# EAGLE design GBM16 (EAGLE 5.07)
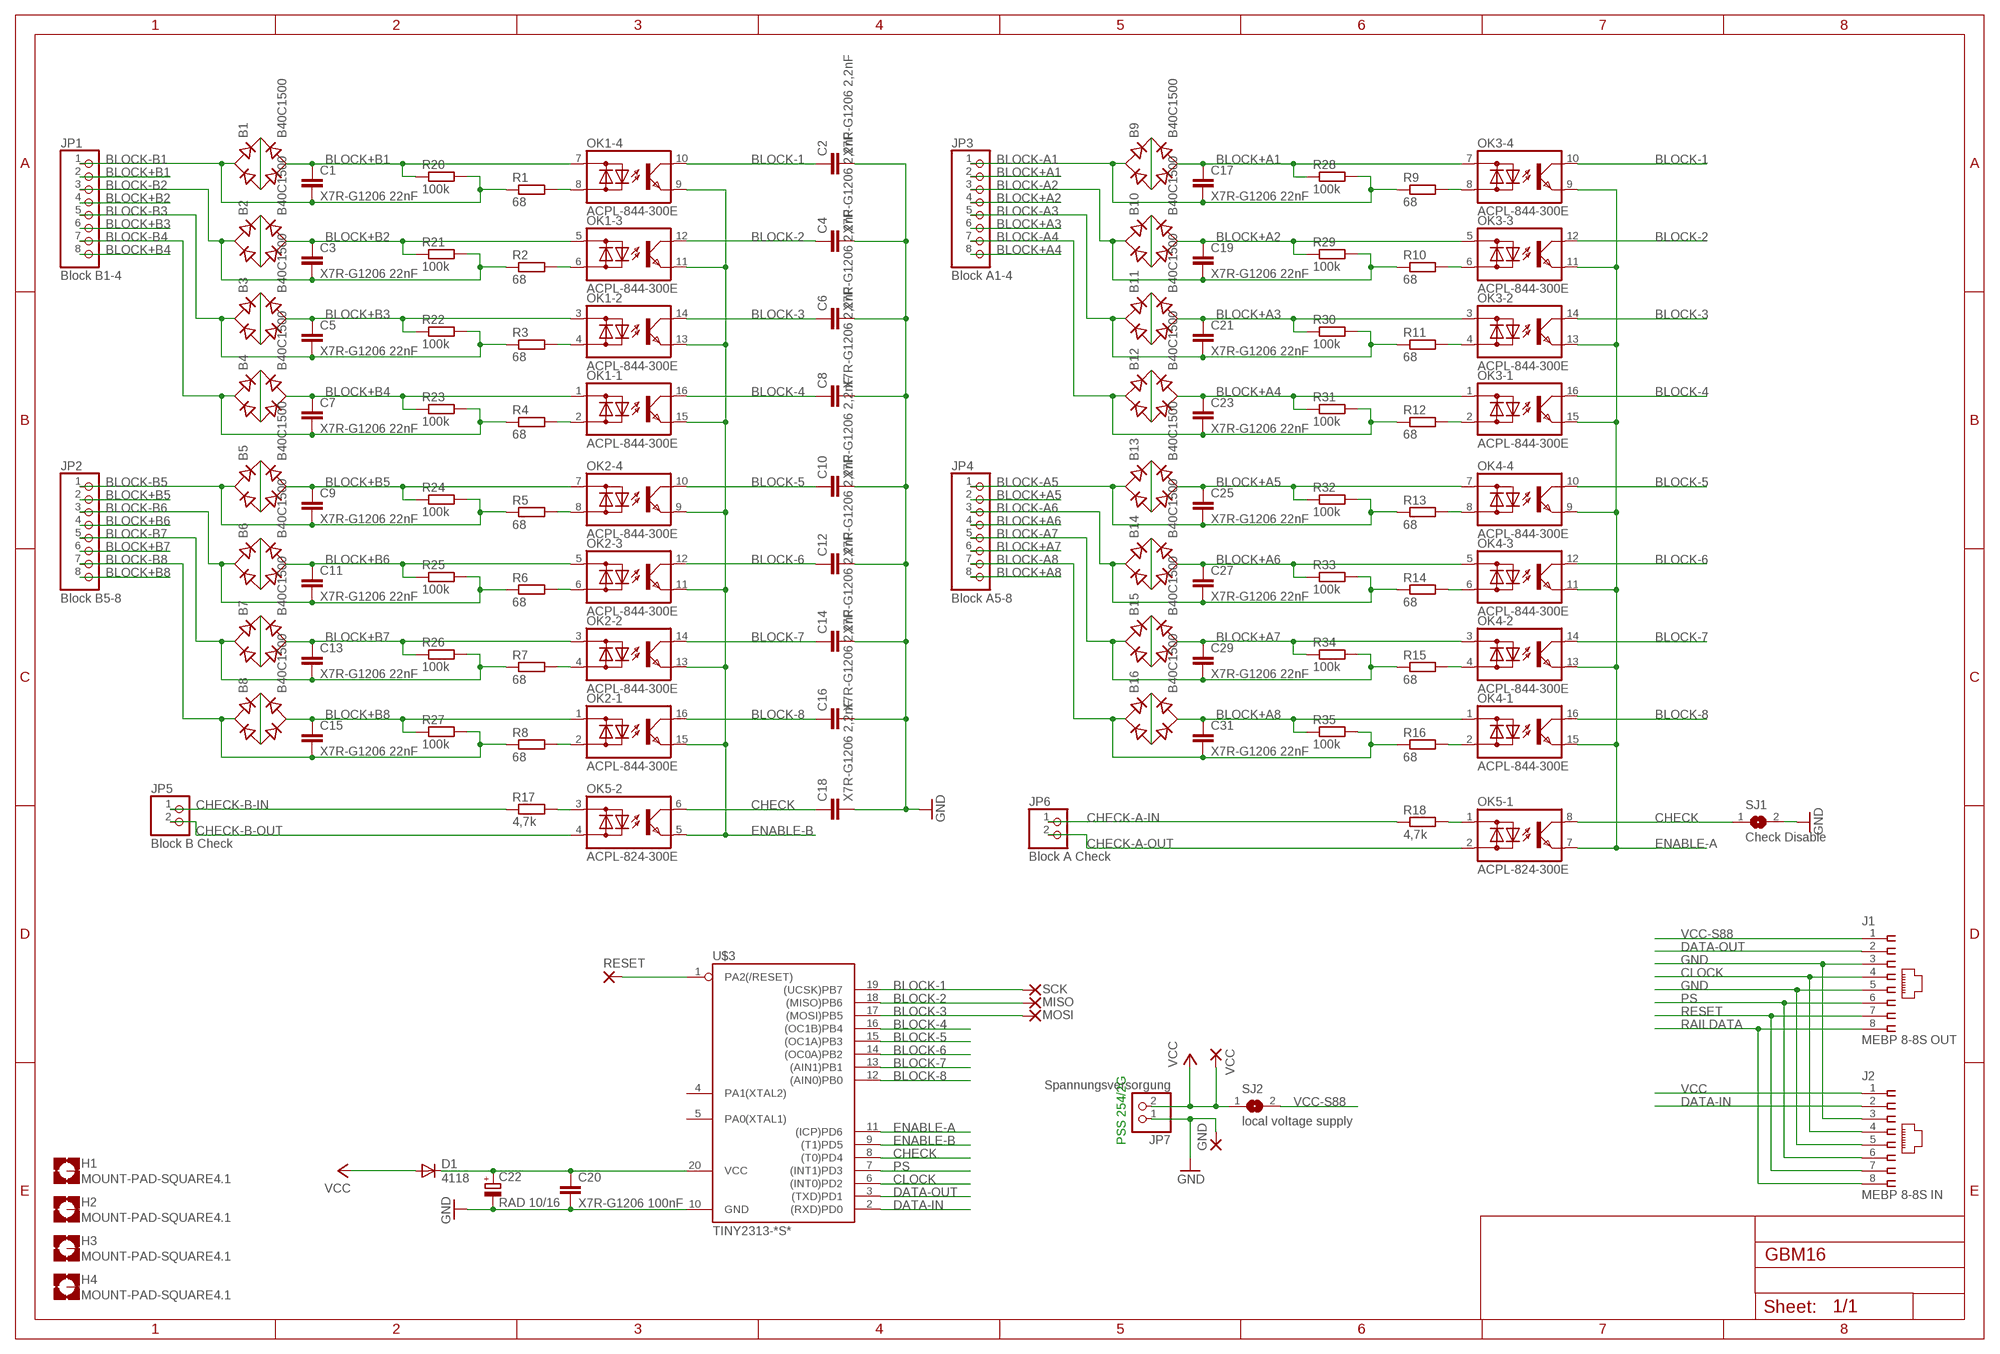
[diagram p0: schematic, sheet 1]

## Parts
B1  B40C1500  RB1A  [RB1A]
B2  B40C1500  RB1A  [RB1A]
B3  B40C1500  RB1A  [RB1A]
B4  B40C1500  RB1A  [RB1A]
B5  B40C1500  RB1A  [RB1A]
B6  B40C1500  RB1A  [RB1A]
B7  B40C1500  RB1A  [RB1A]
B8  B40C1500  RB1A  [RB1A]
B9  B40C1500  RB1A  [RB1A]
B10  B40C1500  RB1A  [RB1A]
B11  B40C1500  RB1A  [RB1A]
B12  B40C1500  RB1A  [RB1A]
B13  B40C1500  RB1A  [RB1A]
B14  B40C1500  RB1A  [RB1A]
B15  B40C1500  RB1A  [RB1A]
B16  B40C1500  RB1A  [RB1A]
C1  X7R-G1206 22nF  C-EUC1206  [C1206]
C2  X7R-G1206 2,2nF  C-EUC1206  [C1206]
C3  X7R-G1206 22nF  C-EUC1206  [C1206]
C4  X7R-G1206 2,2nF  C-EUC1206  [C1206]
C5  X7R-G1206 22nF  C-EUC1206  [C1206]
C6  X7R-G1206 2,2nF  C-EUC1206  [C1206]
C7  X7R-G1206 22nF  C-EUC1206  [C1206]
C8  X7R-G1206 2,2nF  C-EUC1206  [C1206]
C9  X7R-G1206 22nF  C-EUC1206  [C1206]
C10  X7R-G1206 2,2nF  C-EUC1206  [C1206]
C11  X7R-G1206 22nF  C-EUC1206  [C1206]
C12  X7R-G1206 2,2nF  C-EUC1206  [C1206]
C13  X7R-G1206 22nF  C-EUC1206  [C1206]
C14  X7R-G1206 2,2nF  C-EUC1206  [C1206]
C15  X7R-G1206 22nF  C-EUC1206  [C1206]
C16  X7R-G1206 2,2nF  C-EUC1206  [C1206]
C17  X7R-G1206 22nF  C-EUC1206  [C1206]
C18  X7R-G1206 2,2nF  C-EUC1206  [C1206]
C19  X7R-G1206 22nF  C-EUC1206  [C1206]
C20  X7R-G1206 100nF  C-EUC1206  [C1206]
C21  X7R-G1206 22nF  C-EUC1206  [C1206]
C22  RAD 10/16  CPOL-EUE2.5-6  [E2,5-6]
C23  X7R-G1206 22nF  C-EUC1206  [C1206]
C25  X7R-G1206 22nF  C-EUC1206  [C1206]
C27  X7R-G1206 22nF  C-EUC1206  [C1206]
C29  X7R-G1206 22nF  C-EUC1206  [C1206]
C31  X7R-G1206 22nF  C-EUC1206  [C1206]
D1  4118  DIODE-MINIMELF  [MINIMELF]
GND  SMD2  [SMD1,27-2,54]
H1  MOUNT-PAD-SQUARE4.1  [4,1-PAD-SQUARE]
H2  MOUNT-PAD-SQUARE4.1  [4,1-PAD-SQUARE]
H3  MOUNT-PAD-SQUARE4.1  [4,1-PAD-SQUARE]
H4  MOUNT-PAD-SQUARE4.1  [4,1-PAD-SQUARE]
J1  MEBP 8-8S OUT  555162-1  [555162-1]
J2  MEBP 8-8S IN  555162-1  [555162-1]
JP1  Block B1-4  PINHD-1X8  [1X08]
JP2  Block B5-8  PINHD-1X8  [1X08]
JP3  Block A1-4  PINHD-1X8  [1X08]
JP4  Block A5-8  PINHD-1X8  [1X08]
JP5  Block B Check  PINHD-1X2  [1X02]
JP6  Block A Check  PINHD-1X2  [1X02]
JP7  Spannungsversorgung  PINHD-1X2  [1X02]
MISO  SMD2  [SMD1,27-2,54]
MOSI  SMD2  [SMD1,27-2,54]
OK1  ACPL-844-300E  [DIP16]
OK2  ACPL-844-300E  [DIP16]
OK3  ACPL-844-300E  [DIP16]
OK4  ACPL-844-300E  [DIP16]
OK5  ACPL-824-300E  [DIP8]
R1  68  R-EU_R1206  [R1206]
R2  68  R-EU_R1206  [R1206]
R3  68  R-EU_R1206  [R1206]
R4  68  R-EU_R1206  [R1206]
R5  68  R-EU_R1206  [R1206]
R6  68  R-EU_R1206  [R1206]
R7  68  R-EU_R1206  [R1206]
R8  68  R-EU_R1206  [R1206]
R9  68  R-EU_R1206  [R1206]
R10  68  R-EU_R1206  [R1206]
R11  68  R-EU_R1206  [R1206]
R12  68  R-EU_R1206  [R1206]
R13  68  R-EU_R1206  [R1206]
R14  68  R-EU_R1206  [R1206]
R15  68  R-EU_R1206  [R1206]
R16  68  R-EU_R1206  [R1206]
R17  4,7k  R-EU_R1206  [R1206]
R18  4,7k  R-EU_R1206  [R1206]
R20  100k  R-EU_M0805  [M0805]
R21  100k  R-EU_M0805  [M0805]
R22  100k  R-EU_M0805  [M0805]
R23  100k  R-EU_M0805  [M0805]
R24  100k  R-EU_M0805  [M0805]
R25  100k  R-EU_M0805  [M0805]
R26  100k  R-EU_M0805  [M0805]
R27  100k  R-EU_M0805  [M0805]
R28  100k  R-EU_M0805  [M0805]
R29  100k  R-EU_M0805  [M0805]
R30  100k  R-EU_M0805  [M0805]
R31  100k  R-EU_M0805  [M0805]
R32  100k  R-EU_M0805  [M0805]
R33  100k  R-EU_M0805  [M0805]
R34  100k  R-EU_M0805  [M0805]
R35  100k  R-EU_M0805  [M0805]
RESET  SMD2  [SMD1,27-2,54]
SCK  SMD2  [SMD1,27-2,54]
SJ1  Check Disable  SJ  [SJ]
SJ2  local voltage supply  SJ  [SJ]
U$3  TINY2313-*S*  [SO20L$]
VCC  SMD2  [SMD1,27-2,54]

## Nets
BLOCK+A1: B9.AC2 C17.1 JP3.2 OK3.7(-4:AC1) R28.1
BLOCK+A2: B10.AC2 C19.1 JP3.4 OK3.5(-3:AC1) R29.1
BLOCK+A3: B11.AC2 C21.1 JP3.6 OK3.3(-2:AC1) R30.1
BLOCK+A4: B12.AC2 C23.1 JP3.8 OK3.1(-1:AC1) R31.1
BLOCK+A5: B13.AC2 C25.1 JP4.2 OK4.7(-4:AC1) R32.1
BLOCK+A6: B14.AC2 C27.1 JP4.4 OK4.5(-3:AC1) R33.1
BLOCK+A7: B15.AC2 C29.1 JP4.6 OK4.3(-2:AC1) R34.1
BLOCK+A8: B16.AC2 C31.1 JP4.8 OK4.1(-1:AC1) R35.1
BLOCK+B1: B1.AC2 C1.1 JP1.2 OK1.7(-4:AC1) R20.1
BLOCK+B2: B2.AC2 C3.1 JP1.4 OK1.5(-3:AC1) R21.1
BLOCK+B3: B3.AC2 C5.1 JP1.6 OK1.3(-2:AC1) R22.1
BLOCK+B4: B4.AC2 C7.1 JP1.8 OK1.1(-1:AC1) R23.1
BLOCK+B5: B5.AC2 C9.1 JP2.2 OK2.7(-4:AC1) R24.1
BLOCK+B6: B6.AC2 C11.1 JP2.4 OK2.5(-3:AC1) R25.1
BLOCK+B7: B7.AC2 C13.1 JP2.6 OK2.3(-2:AC1) R26.1
BLOCK+B8: B8.AC2 C15.1 JP2.8 OK2.1(-1:AC1) R27.1
BLOCK-1: C2.1 OK1.10(-4:C) OK3.10(-4:C) SCK.1(P) U$3.19((UCSK)PB7)
BLOCK-2: C4.1 MISO.1(P) OK1.12(-3:C) OK3.12(-3:C) U$3.18((MISO)PB6)
BLOCK-3: C6.1 MOSI.1(P) OK1.14(-2:C) OK3.14(-2:C) U$3.17((MOSI)PB5)
BLOCK-4: C8.1 OK1.16(-1:C) OK3.16(-1:C) U$3.16((OC1B)PB4)
BLOCK-5: C10.1 OK2.10(-4:C) OK4.10(-4:C) U$3.15((OC1A)PB3)
BLOCK-6: C12.1 OK2.12(-3:C) OK4.12(-3:C) U$3.14((OC0A)PB2)
BLOCK-7: C14.1 OK2.14(-2:C) OK4.14(-2:C) U$3.13((AIN1)PB1)
BLOCK-8: C16.1 OK2.16(-1:C) OK4.16(-1:C) U$3.12((AIN0)PB0)
BLOCK-A1: B9.AC1 C17.2 JP3.1 R9.1 R28.2
BLOCK-A2: B10.AC1 C19.2 JP3.3 R10.1 R29.2
BLOCK-A3: B11.AC1 C21.2 JP3.5 R11.1 R30.2
BLOCK-A4: B12.AC1 C23.2 JP3.7 R12.1 R31.2
BLOCK-A5: B13.AC1 C25.2 JP4.1 R13.1 R32.2
BLOCK-A6: B14.AC1 C27.2 JP4.3 R14.1 R33.2
BLOCK-A7: B15.AC1 C29.2 JP4.5 R15.1 R34.2
BLOCK-A8: B16.AC1 C31.2 JP4.7 R16.1 R35.2
BLOCK-B1: B1.AC1 C1.2 JP1.1 R1.1 R20.2
BLOCK-B2: B2.AC1 C3.2 JP1.3 R2.1 R21.2
BLOCK-B3: B3.AC1 C5.2 JP1.5 R3.1 R22.2
BLOCK-B4: B4.AC1 C7.2 JP1.7 R4.1 R23.2
BLOCK-B5: B5.AC1 C9.2 JP2.1 R5.1 R24.2
BLOCK-B6: B6.AC1 C11.2 JP2.3 R6.1 R25.2
BLOCK-B7: B7.AC1 C13.2 JP2.5 R7.1 R26.2
BLOCK-B8: B8.AC1 C15.2 JP2.7 R8.1 R27.2
CHECK: C18.1 OK5.6(-2:C) OK5.8(-1:C) SJ1.1 U$3.8((T0)PD4)
CHECK-A-IN: JP6.1 R18.1
CHECK-A-OUT: JP6.2 OK5.2(-1:AC2)
CHECK-B-IN: JP5.1 R17.1
CHECK-B-OUT: JP5.2 OK5.4(-2:AC2)
CLOCK: J1.4 J2.4 U$3.6((INT0)PD2)
DATA-IN: J2.2 U$3.2((RXD)PD0)
DATA-OUT: J1.2 U$3.3((TXD)PD1)
ENABLE-A: OK3.9(-4:E) OK3.11(-3:E) OK3.13(-2:E) OK3.15(-1:E) OK4.9(-4:E) OK4.11(-3:E) OK4.13(-2:E) OK4.15(-1:E) OK5.7(-1:E) U$3.11((ICP)PD6)
ENABLE-B: OK1.9(-4:E) OK1.11(-3:E) OK1.13(-2:E) OK1.15(-1:E) OK2.9(-4:E) OK2.11(-3:E) OK2.13(-2:E) OK2.15(-1:E) OK5.5(-2:E) U$3.9((T1)PD5)
GND: C2.2 C4.2 C6.2 C8.2 C10.2 C12.2 C14.2 C16.2 C18.2 C20.2 C22.- GND.1(P) J1.3 J1.5 J2.3 J2.5 JP7.1 SJ1.2 U$3.10(GND)
N$1: C20.1 C22.+ D1.C U$3.20(VCC)
N$3: OK1.8(-4:AC2) R1.2
N$5: B1.+ B1.-
N$6: OK5.3(-2:AC1) R17.2
N$7: OK5.1(-1:AC1) R18.2
N$10: B2.+ B2.-
N$11: OK2.6(-3:AC2) R6.2
N$13: OK1.6(-3:AC2) R2.2
N$14: OK2.4(-2:AC2) R7.2
N$15: B3.+ B3.-
N$16: OK1.4(-2:AC2) R3.2
N$17: OK2.8(-4:AC2) R5.2
N$18: OK1.2(-1:AC2) R4.2
N$19: B4.+ B4.-
N$20: OK2.2(-1:AC2) R8.2
N$21: OK3.8(-4:AC2) R9.2
N$23: OK3.6(-3:AC2) R10.2
N$24: B5.+ B5.-
N$25: RESET.1(P) U$3.1(PA2(/RESET))
N$26: OK3.4(-2:AC2) R11.2
N$27: B6.+ B6.-
N$29: OK4.6(-3:AC2) R14.2
N$32: OK3.2(-1:AC2) R12.2
N$35: B7.+ B7.-
N$36: OK4.4(-2:AC2) R15.2
N$39: B8.+ B8.-
N$41: OK4.8(-4:AC2) R13.2
N$42: OK4.2(-1:AC2) R16.2
N$44: B9.+ B9.-
N$47: B10.+ B10.-
N$55: B11.+ B11.-
N$59: B12.+ B12.-
N$65: B13.+ B13.-
N$68: B14.+ B14.-
N$76: B15.+ B15.-
N$80: B16.+ B16.-
PS: J1.6 J2.6 U$3.7((INT1)PD3)
RAILDATA: J1.8 J2.8
RESET: J1.7 J2.7
VCC: D1.A J2.1 JP7.2 SJ2.1 VCC.1(P)
VCC-S88: J1.1 SJ2.2
Unconnected: H1.B4,1(MOUNT) H2.B4,1(MOUNT) H3.B4,1(MOUNT) H4.B4,1(MOUNT) U$3.4(PA1(XTAL2)) U$3.5(PA0(XTAL1))

## Notes on the sheet
- PSS 254/2G

## Library data of the parts
B1-B16 = rectifier:RB1A: RECTIFIER 1 A
C1-C21 C23 C25 C27 C29 C31 = rcl:C-EU: CAPACITOR, European symbol
C22 = rcl:CPOL-EU: POLARIZED CAPACITOR, European symbol
D1 = diode:DIODE-: DIODE
GND MISO MOSI RESET SCK VCC = wirepad:SMD2: SMD PAD
H1-H4 = holes:MOUNT-PAD-SQUARE: MOUNTING PAD, square
J1 J2 = con-amp:555162-1: AMP connector
JP1-JP4 = pinhead:PINHD-1X8: PIN HEADER
JP5-JP7 = pinhead:PINHD-1X2: PIN HEADER
OK1-OK4 = my-optocoupler:ACPL-844-300E: FOTOTRANSISTOR/OPTOKOPPLER ACPL-844-300E Conrad Artikel-Nr.: 140222 - 62
OK5 = my-optocoupler:ACPL-824-300E: FOTOTRANSISTOR/OPTOKOPPLER ACPL-824-300E Conrad Artikel-Nr.: 140220 - 62
R1-R18 R20-R35 = rcl:R-EU_: RESISTOR, European symbol
SJ1 SJ2 = jumper:SJ: SMD solder JUMPER
U$3 = avr-6:TINY2313*: Atmel Tiny2313 2K Flash, 128 bytes EEPROM, 128 bytes RAM

## Board
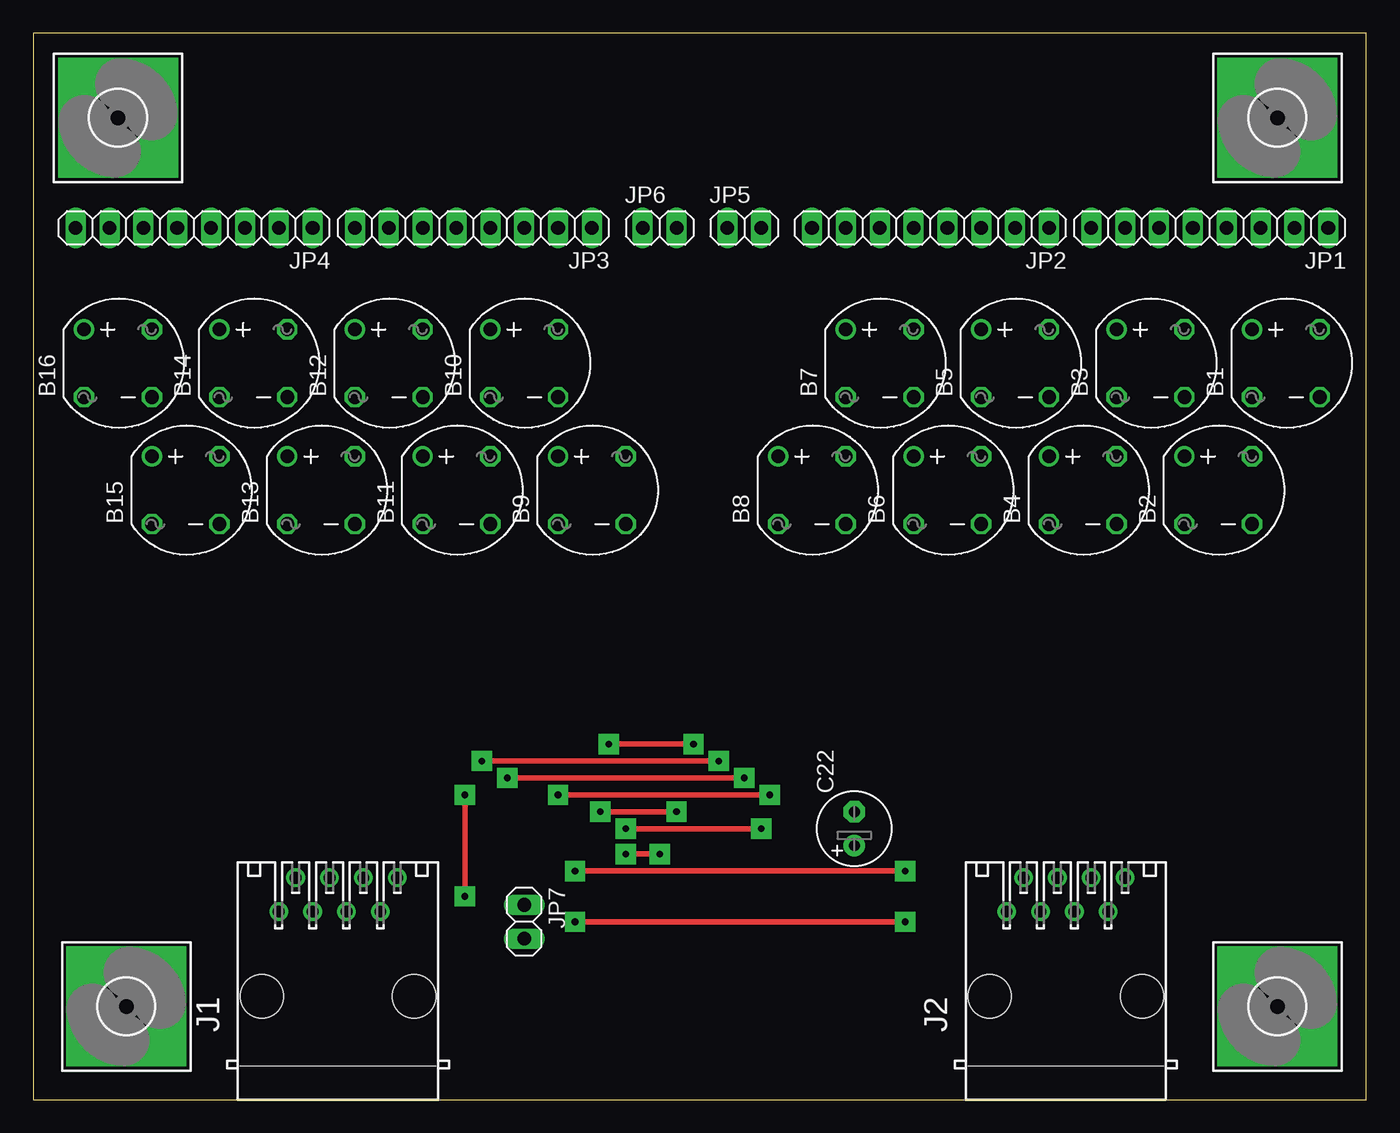
[diagram p1: board, top side]
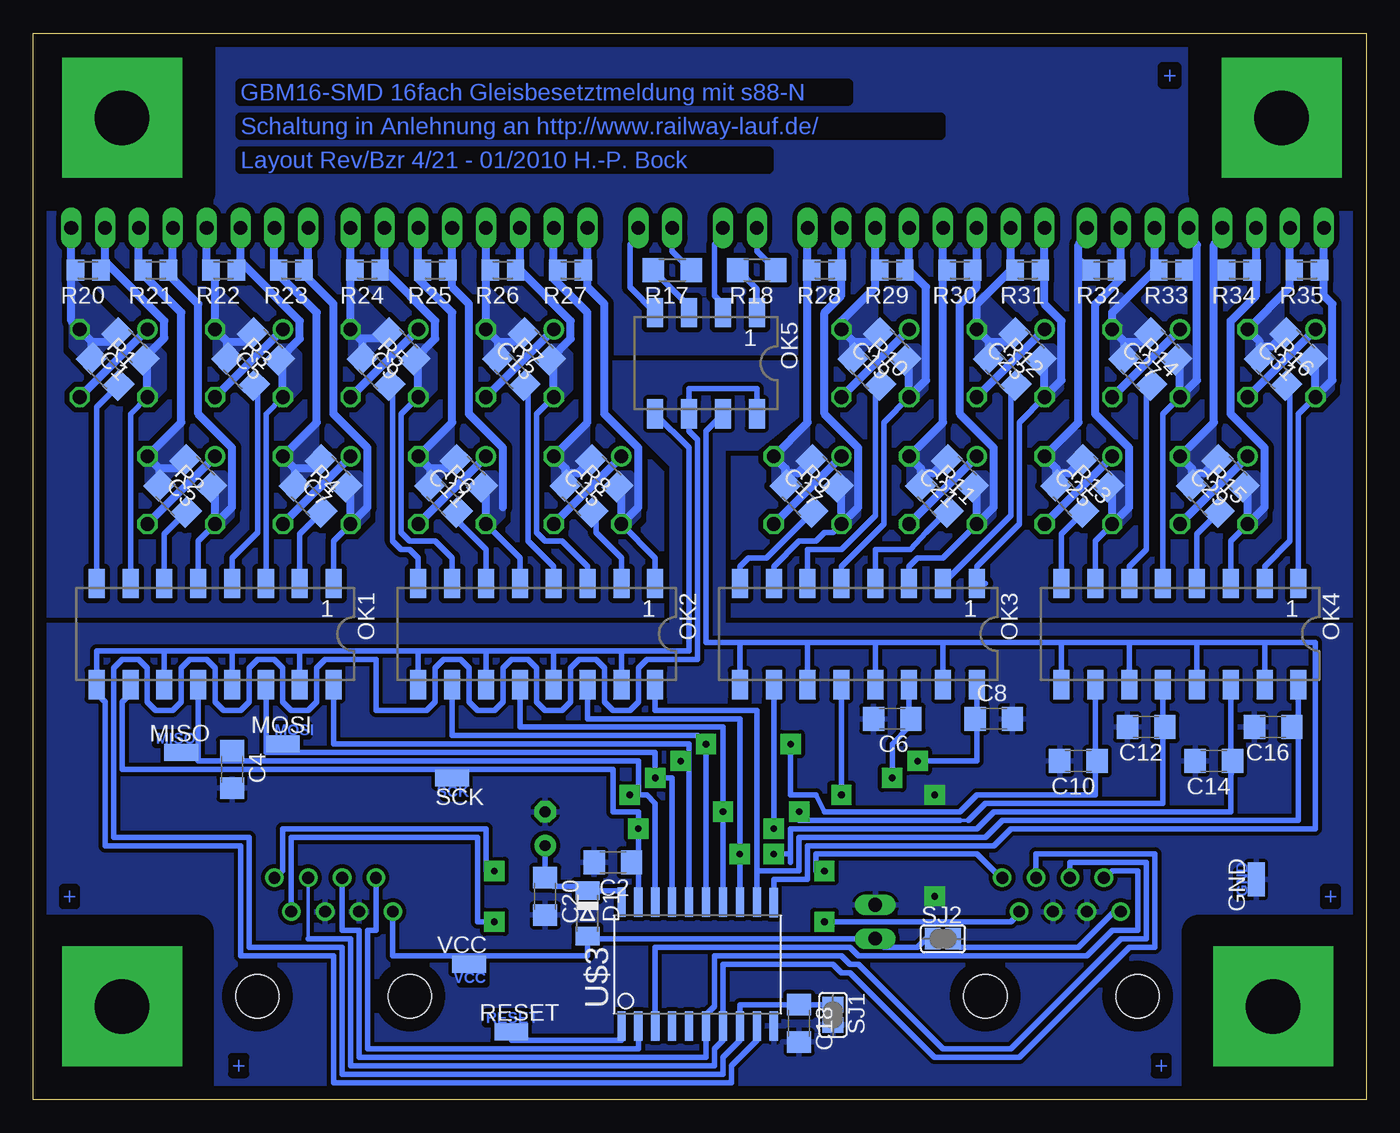
[diagram p2: board, bottom side, seen from below]

Size 100 x 80 mm. Coordinates in mm from the lower left corner, seen from the top.
Outline: 0,0 100,0 100,80 0,80 0,0
Copper layers (1*16): Top 0.035mm / dielectric 1.5mm / Bottom 0.035mm
Design rules "default": minimum track width 10mil, minimum drill 24mil, track to track 8mil, track to pad 8mil, pad to pad 8mil, via to via 8mil, smd to smd 8mil, copper to edge 40mil, drill to drill 8mil, minimum pad ring 10mil, minimum via ring 8mil, stop-mask expansion 4mil, vias tented up to drill 0mil, thermal gap 10mil

### Footprints (pad centres in the part's own frame; a part is rotated, then mirrored left to right if it is on the bottom)
RB1A = drill 1.016 round: + -2.54,2.54 | drill 1.016 octagon: - 2.54,-2.54; AC1 2.54,2.54; AC2 -2.54,-2.54
C1206 = smd 1.6 x 1.8: 1 -1.4,0; 2 1.4,0
E2,5-6 = drill 0.813 pad 1.6 round: + -1.27,0 | drill 0.813 pad 1.6 octagon: - 1.27,0
MINIMELF = smd 1.4 x 1.8: A 1.7,0; C -1.7,0
SMD1,27-2,54 = smd 1.27 x 2.54: 1 0,0
4,1-PAD-SQUARE = drill 4.1 pad 9 square: B4,1 0,0
555162-1 = drill 0.889 round: 1 -4.445,5.207; 2 -3.175,7.747; 3 -1.905,5.207; 4 -0.635,7.747; 5 0.635,5.207; 6 1.905,7.747; 7 3.175,5.207; 8 4.445,7.747 | hole 3.251: -5.715,-1.143; 5.715,-1.143
1X08 = drill 1.016 long: 1 -8.89,0; 2 -6.35,0; 3 -3.81,0; 4 -1.27,0; 5 1.27,0; 6 3.81,0; 7 6.35,0; 8 8.89,0
1X02 = drill 1.016 long: 1 -1.27,0; 2 1.27,0
DIP16 = smd 1.2 x 2.2: 1 -8.89,-3.8; 2 -6.35,-3.8; 3 -3.81,-3.8; 4 -1.27,-3.8; 5 1.27,-3.8; 6 3.81,-3.8; 7 6.35,-3.8; 8 8.89,-3.8; 9 8.89,3.8; 10 6.35,3.8; 11 3.81,3.8; 12 1.27,3.8; 13 -1.27,3.8; 14 -3.81,3.8; 15 -6.35,3.8; 16 -8.89,3.8
DIP8 = smd 1.2 x 2.2: 1 -3.81,-3.8; 2 -1.27,-3.8; 3 1.27,-3.8; 4 3.81,-3.8; 5 3.81,3.8; 6 1.27,3.8; 7 -1.27,3.8; 8 -3.81,3.8
R1206 = smd 1.6 x 1.803: 1 -1.422,0; 2 1.422,0
M0805 = smd 1.3 x 1.6: 1 -0.95,0; 2 0.95,0
SJ = smd 1.168 x 1.6: 1 -0.762,0; 2 0.762,0
SO20L$ = smd 0.61 x 2.21: 1 -5.715,-4.636; 2 -4.445,-4.636; 3 -3.175,-4.636; 4 -1.905,-4.636; 5 -0.635,-4.636; 6 0.635,-4.636; 7 1.905,-4.636; 8 3.175,-4.636; 9 4.445,-4.636; 10 5.715,-4.636; 11 5.715,4.61; 12 4.445,4.636; 13 3.175,4.636; 14 1.905,4.636; 15 0.635,4.636; 16 -0.635,4.636; 17 -1.905,4.636; 18 -3.175,4.636; 19 -4.445,4.636; 20 -5.715,4.636

### Placement (x,y rotation side)
B1  93.98,55.24 0 top
B2  88.9,45.72 0 top
B3  83.82,55.24 0 top
B4  78.74,45.72 0 top
B5  73.66,55.24 0 top
B6  68.58,45.72 0 top
B7  63.5,55.24 0 top
B8  58.42,45.72 0 top
B9  41.91,45.72 0 top
B10  36.83,55.24 0 top
B11  31.75,45.72 0 top
B12  26.67,55.24 0 top
B13  21.59,45.72 0 top
B14  16.51,55.24 0 top
B15  11.43,45.72 0 top
B16  6.35,55.24 0 top
C1  92.71,56.52 135 bottom
C2  56.52,17.78 180 bottom
C3  87.63,46.99 135 bottom
C4  85.09,24.77 270 bottom
C5  82.55,56.52 135 bottom
C6  35.56,28.57 180 bottom
C7  77.47,46.99 135 bottom
C8  27.94,28.57 0 bottom
C9  72.39,56.52 135 bottom
C10  21.59,25.4 180 bottom
C11  67.31,46.99 135 bottom
C12  16.51,27.94 180 bottom
C13  62.23,56.52 135 bottom
C14  11.43,25.4 180 bottom
C15  57.15,46.99 135 bottom
C16  6.99,27.94 180 bottom
C17  40.64,46.99 135 bottom
C18  42.55,5.71 270 bottom
C19  35.56,56.52 135 bottom
C20  61.59,15.24 270 bottom
C21  30.48,46.99 135 bottom
C22  61.59,20.32 90 top
C23  25.4,56.52 135 bottom
C25  20.32,46.99 135 bottom
C27  15.24,56.52 135 bottom
C29  10.16,46.99 135 bottom
C31  5.08,56.52 135 bottom
D1  58.42,13.97 270 bottom
GND  8.26,16.51 0 bottom
H1  6.35,73.66 0 top
H2  93.34,73.66 0 top
H3  6.99,6.99 0 top
H4  93.34,6.99 0 top
J1  22.86,8.89 0 top
J2  77.47,8.89 0 top
JP1  88.27,65.41 180 top
JP2  67.31,65.41 180 top
JP3  33.02,65.41 180 top
JP4  12.06,65.41 180 top
JP5  53.34,65.41 0 top
JP6  46.99,65.41 0 top
JP7  36.83,13.34 270 top
MISO  88.9,26.04 270 bottom
MOSI  81.28,26.67 270 bottom
OK1  86.36,34.92 180 bottom
OK2  62.23,34.92 180 bottom
OK3  38.1,34.92 180 bottom
OK4  13.97,34.92 180 bottom
OK5  49.53,55.24 180 bottom
R1  94.61,54.61 315 bottom
R2  89.53,45.09 315 bottom
R3  84.45,54.61 315 bottom
R4  79.38,45.09 315 bottom
R5  74.3,54.61 315 bottom
R6  69.22,45.09 315 bottom
R7  64.14,54.61 315 bottom
R8  59.05,45.09 315 bottom
R9  42.55,45.09 315 bottom
R10  37.47,54.61 315 bottom
R11  32.38,45.09 315 bottom
R12  27.3,54.61 315 bottom
R13  22.23,45.09 315 bottom
R14  17.14,54.61 315 bottom
R15  12.06,45.09 315 bottom
R16  6.99,54.61 315 bottom
R17  52.07,62.23 180 bottom
R18  45.72,62.23 180 bottom
R20  95.89,62.23 180 bottom
R21  90.81,62.23 180 bottom
R22  85.72,62.23 180 bottom
R23  80.64,62.23 180 bottom
R24  74.93,62.23 180 bottom
R25  69.85,62.23 180 bottom
R26  64.77,62.23 180 bottom
R27  59.69,62.23 180 bottom
R28  40.64,62.23 180 bottom
R29  35.56,62.23 180 bottom
R30  30.48,62.23 180 bottom
R31  25.4,62.23 180 bottom
R32  19.68,62.23 180 bottom
R33  14.61,62.23 180 bottom
R34  9.53,62.23 180 bottom
R35  4.45,62.23 180 bottom
RESET  64.14,5.08 270 bottom
SCK  68.58,24.13 90 bottom
SJ1  40.01,6.35 270 bottom
SJ2  31.75,12.06 0 bottom
U$3  50.16,10.16 0 bottom
VCC  67.31,10.16 270 bottom

### Tracks (layer width: path | path; a pad name or v marks a point on that pad's centre or on a via)
BLOCK+A1
  Bottom 0.406: B9.AC2 40.01,42.55 40.64,42.55 41.27,41.91 42.55,41.91 44.45,40.01 OK3.7 | 39.37,60.33 39.37,61.91 R28.1
  Bottom 0.6: C17.1 39.37,45.72 B9.AC2 38.1,44.45 38.1,48.9 40.64,51.44 40.64,59.05 39.37,60.33 JP3.2
  pour Bottom (isolate 0.254, no thermals): 39.37,42.55 38.1,43.81 38.1,46.35 38.73,46.99 39.37,46.99
BLOCK+A2
  Bottom 0.406: B10.AC2 36.2,50.8 36.2,43.18 39.37,40.01 OK3.5 | 34.29,62.23 R29.1
  Bottom 0.6: C19.1 34.29,55.24 B10.AC2 33.02,53.98 33.02,60.96 34.29,62.23 JP3.4
  pour Bottom (isolate 0.254, no thermals): 34.29,52.07 33.02,53.34 33.02,55.88 33.66,56.52 34.29,56.52
BLOCK+A3
  Bottom 0.406: B11.AC2 31.75,40.64 33.66,40.64 34.29,40.01 OK3.3 | 29.21,60.96 29.21,61.91 R30.1
  Bottom 0.6: C21.1 29.21,45.72 B11.AC2 27.94,44.45 27.94,48.9 30.48,51.44 30.48,59.69 29.21,60.96 JP3.6
  pour Bottom (isolate 0.254, no thermals): 29.21,42.55 27.94,43.81 27.94,46.35 28.57,46.99 29.21,46.99
BLOCK+A4
  Bottom 0.406: B12.AC2 26.04,50.8 26.04,43.18 29.21,40.01 OK3.1 28.59,38.73 | 24.13,59.69 24.13,61.91 R31.1
  Bottom 0.6: C23.1 24.13,55.24 B12.AC2 22.86,53.98 22.86,58.42 24.13,59.69 JP3.8
  pour Bottom (isolate 0.254, no thermals): 24.13,52.07 22.86,53.34 22.86,55.88 23.5,56.52 24.13,56.52
BLOCK+A5
  Bottom 0.406: B13.AC2 20.32,41.91 OK4.7 | 18.41,61.59 18.41,61.91 R32.1
  Bottom 0.6: C25.1 19.05,45.72 B13.AC2 17.78,44.45 17.78,48.9 20.32,51.44 20.32,59.69 18.41,61.59 JP4.2
  pour Bottom (isolate 0.254, no thermals): 19.05,42.55 17.78,43.81 17.78,46.35 18.41,46.99 19.05,46.99
BLOCK+A6
  Bottom 0.406: B14.AC2 15.24,51.44 OK4.5 | 12.7,64.14 12.7,63.19 R33.1
  Bottom 0.6: C27.1 13.97,55.24 B14.AC2 12.7,53.98 12.7,64.14 13.34,64.77 JP4.4
  pour Bottom (isolate 0.254, no thermals): 13.97,52.07 12.7,53.34 12.7,55.88 13.34,56.52 13.97,56.52
BLOCK+A7
  Bottom 0.406: B15.AC2 10.16,41.91 OK4.3 | 8.26,60.33 8.26,61.91 R34.1
  Bottom 0.6: C29.1 8.89,45.72 B15.AC2 7.62,44.45 7.62,48.9 10.16,51.44 10.16,58.42 8.26,60.33 JP4.6
  pour Bottom (isolate 0.254, no thermals): 8.89,42.55 7.62,43.81 7.62,46.35 8.26,46.99 8.89,46.99
BLOCK+A8
  Bottom 0.406: B16.AC2 5.08,51.44 OK4.1 | 3.17,60.33 3.17,61.91 R35.1
  Bottom 0.6: C31.1 3.81,55.24 B16.AC2 2.54,53.98 2.54,59.69 3.17,60.33 JP4.8
  pour Bottom (isolate 0.254, no thermals): 3.81,52.07 2.54,53.34 2.54,55.88 3.17,56.52 3.81,56.52
BLOCK+B1
  Bottom 0.406: B1.AC2 92.71,51.44 OK1.7 | 94.61,62.87 94.61,62.55 R20.1
  Bottom 0.6: B1.AC2 91.44,55.24 C1.1 91.72,55.6 90.17,57.15 90.17,58.42 94.61,62.87 JP1.2
  pour Bottom (isolate 0.254, no thermals): 91.44,52.07 90.17,53.34 90.17,55.88 90.81,56.52 91.44,56.52
BLOCK+B2
  Bottom 0.406: B2.AC2 87.63,41.91 OK1.5 | 89.53,61.59 89.53,61.91 R21.1
  Bottom 0.6: C3.1 86.36,45.72 B2.AC2 85.09,44.45 85.09,48.9 87.63,51.44 87.63,59.69 89.53,61.59 JP1.4
  pour Bottom (isolate 0.254, no thermals): 86.36,42.55 85.09,43.81 85.09,46.35 85.72,46.99 86.36,46.99
BLOCK+B3
  Bottom 0.406: B3.AC2 82.55,51.44 OK1.3 | 84.45,62.87 84.45,62.55 R22.1
  Bottom 0.6: B3.AC2 81.28,55.24 C5.1 80.01,57.08 80.01,58.42 84.45,62.87 JP1.6
  pour Bottom (isolate 0.254, no thermals): 81.28,52.07 80.01,53.34 80.01,55.88 80.64,56.52 81.28,56.52
BLOCK+B4
  Bottom 0.406: B4.AC2 77.47,41.91 OK1.1 | 79.38,61.59 79.38,61.91 R23.1
  Bottom 0.6: C7.1 76.2,45.72 B4.AC2 74.93,44.45 74.93,48.9 77.47,51.44 77.47,59.69 79.38,61.59 JP1.8
  pour Bottom (isolate 0.254, no thermals): 76.2,42.55 74.93,43.81 74.93,46.35 75.56,46.99 76.2,46.99
BLOCK+B5
  Bottom 0.406: B5.AC2 72.39,51.44 72.39,42.55 71.75,41.91 69.85,41.91 68.58,40.64 OK2.7 | 73.66,62.23 R24.1
  Bottom 0.6: B5.AC2 71.12,55.24 C9.1 69.85,57.08 69.85,58.42 73.66,62.23 JP2.2
  pour Bottom (isolate 0.254, no thermals): 71.12,52.07 69.85,53.34 69.85,55.88 70.48,56.52 71.12,56.52
BLOCK+B6
  Bottom 0.406: B6.AC2 63.5,40.64 OK2.5 | 68.58,60.96 68.58,61.91 R25.1
  Bottom 0.6: B6.AC2 66.04,45.72 C11.1 | JP2.4 68.58,60.96 67.31,59.69 67.31,51.44 64.77,48.9 64.77,44.45
  pour Bottom (isolate 0.254, no thermals): 66.04,42.55 64.77,43.81 64.77,46.35 65.41,46.99 66.04,46.99
BLOCK+B7
  Bottom 0.406: B7.AC2 62.23,51.44 62.23,42.55 61.59,41.91 60.33,41.91 58.42,40.01 OK2.3 | 63.5,62.23 R26.1
  Bottom 0.6: B7.AC2 60.96,55.24 C13.1 59.69,57.08 59.69,58.42 63.5,62.23 JP2.6
  pour Bottom (isolate 0.254, no thermals): 60.96,52.07 59.69,53.34 59.69,55.88 60.33,56.52 60.96,56.52
BLOCK+B8
  Bottom 0.406: B8.AC2 53.34,40.64 OK2.1 | 58.42,60.96 58.42,61.91 R27.1
  Bottom 0.6: C15.1 55.88,45.72 B8.AC2 54.61,44.45 54.61,48.9 57.15,51.44 57.15,59.69 58.42,60.96 JP2.8
  pour Bottom (isolate 0.254, no thermals): 55.88,42.55 54.61,43.81 54.61,46.35 55.24,46.99 55.88,46.99
BLOCK-1  (via drill 0.5 pad 1.52)
  Top 0.406: v44.45,20.32 v54.61,20.32
  Bottom 0.406: OK1.10 92.71,30.48 93.34,29.84 93.34,24.77 68.58,24.77 | 68.58,24.77 56.52,24.77 56.52,21.59 54.61,21.59 v54.61,20.32 54.61,17.78 | 54.61,17.78 U$3.19 | v44.45,20.32 OK3.10 | 54.61,17.78 C2.1 | 68.58,24.77 SCK.1
BLOCK-2  (via drill 0.5 pad 1.52)
  Top 0.406: v39.37,22.86 v55.24,22.86
  Bottom 0.406: U$3.18 53.34,22.23 53.98,22.86 54.61,22.86 | v55.24,22.86 54.61,22.86 | 54.61,22.86 54.61,25.4 84.45,25.4 | 87.63,26.04 87.63,25.4 84.45,25.4 | 87.63,26.04 OK1.12 | v39.37,22.86 OK3.12 | 84.45,25.4 C4.1 | 87.63,26.04 MISO.1
BLOCK-3  (via drill 0.5 pad 1.52)
  Top 0.406: v35.56,24.13 v53.34,24.13
  Bottom 0.406: U$3.17 52.07,24.13 v53.34,24.13 53.34,26.04 80.64,26.04 | 80.64,26.04 82.55,26.04 OK1.14 | 34.29,27.94 OK3.14 | v35.56,24.13 35.56,26.67 34.29,27.94 | C6.1 34.16,27.94 34.29,27.94 | 80.64,26.04 MOSI.1
BLOCK-4  (via drill 0.5 pad 1.52)
  Top 0.406: v33.66,25.4 v51.44,25.4
  Bottom 0.406: v33.66,25.4 29.21,25.4 OK3.16 29.21,28.57 C8.1 | 50.8,25.4 v51.44,25.4 50.8,25.4 | 50.8,25.4 U$3.16 | 50.8,25.4 50.8,26.67 77.47,26.67 OK1.16
BLOCK-5  (via drill 0.5 pad 1.52)
  Top 0.406: v43.18,26.67 v49.53,26.67
  Bottom 0.406: OK2.10 68.58,27.3 50.16,27.3 v49.53,26.67 U$3.15 | v43.18,26.67 43.18,22.86 41.27,22.86 40.64,21.59 30.48,21.59 29.21,22.86 20.32,22.86 20.32,24.77 | 20.32,24.77 OK4.10 | C10.1 20.19,24.77 20.32,24.77
BLOCK-6  (via drill 0.5 pad 1.52)
  Top 0.406: v42.55,21.59 v48.26,21.59
  Bottom 0.254: 29.84,20.95 30.48,20.95
  Bottom 0.406: OK2.12 63.5,27.94 48.26,27.94 v48.26,21.59 U$3.14 | 15.24,22.23 OK4.12 | 15.24,22.23 28.57,22.23 29.84,20.95 | 30.48,20.95 42.55,20.95 v42.55,21.59 | 15.24,22.23 15.24,27.3 C12.1
BLOCK-7  (via drill 0.5 pad 1.52)
  Top 0.406: v44.45,18.41 v46.99,18.41
  Bottom 0.406: OK2.14 58.42,28.57 46.99,28.57 v46.99,18.41 U$3.13 | 10.16,21.59 OK4.14 | 10.16,21.59 27.94,21.59 29.21,20.32 43.18,20.32 43.18,18.41 | 43.18,18.41 43.18,17.78 | 43.18,18.41 v44.45,18.41 | 10.16,21.59 10.16,24.13 C14.1
BLOCK-8
  Bottom 0.406: OK2.16 53.34,29.21 45.72,29.21 45.72,17.14 | 45.72,17.14 U$3.12 | 45.72,17.14 42.55,17.14 42.55,19.68 28.57,19.68 27.3,20.95 5.08,20.95 OK4.16 5.08,27.94 C16.1
BLOCK-A1
  Bottom 0.406: JP3.1 41.91,62.55 R28.2
  Bottom 0.6: 43.55,46.99 R9.1 | 43.55,46.99 43.55,47.36 B9.AC1 41.91,50.8 JP3.1 | C17.2 42.62,46.99 43.55,46.99
  pour Bottom (isolate 0.254, no thermals): 41.27,48.26 43.81,45.72 44.45,46.35 44.45,48.26 41.91,50.8 41.91,48.9
BLOCK-A2
  Bottom 0.406: 36.83,61.91 R29.2
  Bottom 0.6: 38.47,56.89 B10.AC1 39.37,58.42 36.83,60.96 36.83,61.91 JP3.3 | R10.1 38.47,56.89 | C19.2 37.17,56.89 38.47,56.89
  pour Bottom (isolate 0.254, no thermals): 36.2,57.78 38.73,55.24 39.37,55.88 39.37,57.78 36.83,60.33 36.83,58.42
BLOCK-A3
  Bottom 0.406: JP3.5 31.75,62.55 R30.2
  Bottom 0.6: 33.39,46.99 R11.1 | 33.39,46.99 33.39,47.36 B11.AC1 31.75,50.8 JP3.5 | C21.2 32.46,46.99 33.39,46.99
  pour Bottom (isolate 0.254, no thermals): 31.11,48.26 33.66,45.72 34.29,46.35 34.29,48.26 31.75,50.8 31.75,48.9
BLOCK-A4
  Bottom 0.406: 26.67,62.23 R31.2
  Bottom 0.6: 28.31,56.89 B12.AC1 29.21,59.69 26.67,62.23 JP3.7 | R12.1 28.31,56.89 | C23.2 27.01,56.89 28.31,56.89
  pour Bottom (isolate 0.254, no thermals): 26.04,57.78 28.57,55.24 29.21,55.88 29.21,60.96
BLOCK-A5
  Bottom 0.406: 21.59,64.14 21.59,63.19 R32.2
  Bottom 0.6: 23.23,46.99 R13.1 | 23.23,46.99 23.23,47.36 B13.AC1 21.59,50.8 21.59,64.14 20.95,64.77 JP4.1 | C25.2 22.3,46.99 23.23,46.99
  pour Bottom (isolate 0.254, no thermals): 20.95,48.26 23.5,45.72 24.13,46.35 24.13,48.26 21.59,50.16 21.59,48.9
BLOCK-A6
  Bottom 0.406: 15.88,62.23 R33.2
  Bottom 0.6: 18.15,56.89 B14.AC1 19.05,59.05 15.88,62.23 JP4.3 | R14.1 18.15,56.89 | C27.2 16.85,56.89 18.15,56.89
  pour Bottom (isolate 0.254, no thermals): 15.88,57.78 18.41,55.24 19.05,55.88 19.05,60.96
BLOCK-A7
  Bottom 0.406: 11.43,62.23 R34.2
  Bottom 0.6: 13.07,46.99 R15.1 | 13.07,46.99 13.07,47.36 B15.AC1 11.43,50.8 11.43,62.23 11.43,64.14 10.79,64.77 JP4.5 | C29.2 12.14,46.99 13.07,46.99
  pour Bottom (isolate 0.254, no thermals): 10.79,48.26 13.34,45.72 13.97,46.35 13.97,48.26 11.43,50.8 11.43,48.9
BLOCK-A8
  Bottom 0.406: 5.71,60.96 5.71,61.91 R35.2
  Bottom 0.6: R16.1 7.99,56.52 | 7.99,56.52 7.99,56.89 B16.AC1 5.71,60.96 JP4.7 | C31.2 7.06,56.52 7.99,56.52
  pour Bottom (isolate 0.254, no thermals): 5.71,57.78 8.26,55.24 8.89,55.88 8.89,57.78 6.35,60.33 6.35,58.42
BLOCK-B1
  Bottom 0.406: JP1.1 97.16,62.55 R20.2
  Bottom 0.6: JP1.1 97.16,58.42 B1.AC1 95.62,56.89 | R1.1 95.62,56.89 | C1.2 94.32,56.89 95.62,56.89
  pour Bottom (isolate 0.254, no thermals): 93.34,57.78 95.89,55.24 97.16,56.52 97.16,61.59
BLOCK-B2
  Bottom 0.406: 92.08,62.23 R21.2
  Bottom 0.6: 90.54,47.36 B2.AC1 88.9,50.8 88.9,59.05 92.08,62.23 JP1.3 | 90.54,47.36 R2.1 | C3.2 89.24,47.36 90.54,47.36
  pour Bottom (isolate 0.254, no thermals): 88.27,48.26 90.81,45.72 91.44,46.35 91.44,48.26 88.9,50.8 88.9,48.9
BLOCK-B3
  Bottom 0.406: 87,62.23 R22.2
  Bottom 0.6: JP1.5 87,62.23 86.36,61.59 B3.AC1 85.46,56.89 | R3.1 85.46,56.89 | C5.2 84.16,56.89 85.46,56.89
  pour Bottom (isolate 0.254, no thermals): 83.19,57.78 85.72,55.24 86.36,55.88 86.36,60.96
BLOCK-B4
  Bottom 0.406: 81.92,62.23 R23.2
  Bottom 0.6: 80.38,47.36 B4.AC1 78.74,50.8 78.74,59.05 81.92,62.23 JP1.7 | 80.38,47.36 R4.1 | C7.2 79.08,47.36 80.38,47.36
  pour Bottom (isolate 0.254, no thermals): 78.11,48.26 80.64,45.72 81.28,46.35 81.28,48.26 78.74,50.8 78.74,48.9
BLOCK-B5
  Bottom 0.406: JP2.1 76.2,62.55 R24.2
  Bottom 0.6: JP2.1 B5.AC1 75.56,57.15 | 75.56,57.15 75.3,56.89 R5.1 | C9.2 73.73,57.15 75.56,57.15
  pour Bottom (isolate 0.254, no thermals): 73.03,57.78 75.56,55.24 76.2,55.88 76.2,60.96
BLOCK-B6
  Bottom 0.406: 71.12,61.59 71.12,61.91 R25.2
  Bottom 0.6: 70.22,47.36 B6.AC1 68.58,50.8 68.58,59.05 71.12,61.59 JP2.3 | 70.22,47.36 R6.1 | C11.2 68.92,47.36 70.22,47.36
  pour Bottom (isolate 0.254, no thermals): 67.94,48.26 70.48,45.72 71.12,46.35 71.12,48.26 68.58,50.8 68.58,48.9
BLOCK-B7
  Bottom 0.406: JP2.5 66.04,62.55 R26.2
  Bottom 0.6: JP2.5 B7.AC1 65.14,56.89 | R7.1 65.14,56.89 | C13.2 63.84,56.89 65.14,56.89
  pour Bottom (isolate 0.254, no thermals): 62.87,57.78 65.41,55.24 66.04,55.88 66.04,60.96
BLOCK-B8
  Bottom 0.406: 60.96,61.59 60.96,61.91 R27.2
  Bottom 0.6: JP2.7 60.96,61.59 58.42,59.05 58.42,50.8 B8.AC1 60.06,47.36 60.06,46.99 | 60.06,46.99 R8.1 | C15.2 59.13,46.99 60.06,46.99
  pour Bottom (isolate 0.254, no thermals): 57.78,48.26 60.33,45.72 60.96,46.35 60.96,48.26 58.42,50.8 58.42,48.9
CHECK
  Bottom 0.406: SJ1.1 C18.1 46.99,7.11 U$3.8 46.99,4.45 48.26,3.17 48.26,1.91 76.83,1.91 76.83,11.43 83.82,11.43 83.82,19.68 93.98,19.68 93.98,32.38 93.34,33.02 92.08,33.02 91.44,32.38 91.44,29.84 90.81,29.21 89.53,29.21 88.9,29.84 88.9,32.38 88.27,33.02 87,33.02 86.36,32.38 86.36,29.84 85.72,29.21 84.45,29.21 83.82,29.84 83.82,32.38 83.19,33.02 81.92,33.02 81.28,32.38 81.28,29.84 80.64,29.21 79.38,29.21 78.74,29.84 78.74,32.38 78.11,33.02 74.3,33.02 74.3,29.21 70.48,29.21 69.85,29.84 69.85,32.38 69.22,33.02 67.94,33.02 67.31,32.38 67.31,29.84 66.67,29.21 65.41,29.21 64.77,29.84 64.77,32.38 64.14,33.02 62.87,33.02 62.23,32.38 62.23,29.84 61.59,29.21 60.33,29.21 59.69,29.84 59.69,32.38 59.05,33.02 57.78,33.02 57.15,32.38 57.15,29.84 56.52,29.21 55.24,29.21 54.61,29.84 54.61,32.38 53.98,33.02 50.16,33.02 50.16,49.53 50.8,50.16 OK5.6 50.8,53.34 45.72,53.34 OK5.8
CHECK-A-IN
  Bottom 0.406: R18.1 45.72,63.65 JP6.1
CHECK-A-OUT
  Bottom 0.406: OK5.2 48.26,59.69 48.9,60.33 48.9,64.14 48.26,64.77 JP6.2
CHECK-B-IN
  Bottom 0.406: R17.1 52.07,63.65 JP5.1
CHECK-B-OUT
  Bottom 0.406: OK5.4 55.24,60.95 55.24,64.14 54.61,64.77 JP5.2
CLOCK
  Bottom 0.406: J2.4 76.83,12.7 75.56,12.7 75.56,3.17 49.53,3.17 U$3.6 49.53,6.35 48.9,6.99 48.9,10.79 39.37,10.79 38.73,10.16 38.1,10.16 31.75,3.81 26.67,3.81 18.41,12.06 16.51,12.06 16.51,17.78 22.23,17.78 J1.4
DATA-IN
  Bottom 0.406: J2.2 74.3,12.7 74.93,12.7 74.93,3.81 54.61,3.81 U$3.2
DATA-OUT
  Bottom 0.406: U$3.3 53.34,11.43 38.73,11.43 38.1,10.79 20.95,10.79 19.05,12.7 17.14,12.7 17.14,17.14 19.05,17.14 19.56,16.64 J1.2
ENABLE-A
  Bottom 0.406: 7.62,34.29 OK4.15 | 7.62,34.29 12.7,34.29 | 12.7,34.29 OK4.13 | 17.78,34.29 OK4.11 | 12.7,34.29 17.78,34.29 | 22.86,34.29 OK4.9 | 17.78,34.29 22.86,34.29 | 22.86,34.29 31.75,34.29 | 31.75,34.29 OK3.15 | 46.99,34.29 OK3.9 | 31.75,34.29 36.83,34.29 | 36.83,34.29 41.91,34.29 | 41.91,34.29 46.99,34.29 | 41.91,34.29 OK3.11 | 36.83,34.29 OK3.13 | 46.99,34.29 49.53,34.29 49.53,50.17 OK5.7 | 7.62,34.29 3.81,34.29 3.81,20.32 26.67,20.32 27.94,19.05 41.91,19.05 41.91,16.51 44.45,16.51 U$3.11
ENABLE-B
  Bottom 0.406: 55.88,33.66 OK2.15 | 55.88,33.66 50.8,33.66 50.8,48.91 OK5.5 | 60.96,33.66 55.88,33.66 | 66.04,33.66 60.96,33.66 | 71.12,33.66 66.04,33.66 | 80.01,33.66 71.12,33.66 | 85.09,33.66 80.01,33.66 | 90.17,33.66 85.09,33.66 | 90.17,33.66 95.25,33.66 OK1.9 95.25,30.48 94.61,29.84 94.61,19.05 84.45,19.05 84.45,10.79 77.47,10.79 77.47,1.27 47.62,1.27 47.62,2.54 45.72,4.45 U$3.9 | 90.17,33.66 OK1.11 | 85.09,33.66 OK1.13 | 80.01,33.66 OK1.15 | 71.12,33.66 OK2.9 | 66.04,33.66 OK2.11 | 60.96,33.66 OK2.13
GND  (via drill 0.5 pad 1.52)
  Top 0.406: v32.38,15.24 v32.38,22.86
  pour Bottom (isolate 0.3, rank 2): 0,0 100.33,0 99.69,35.56 52.07,35.56 52.07,47.62 56.52,52.07 56.52,55.24 42.55,55.24 42.55,51.44 45.72,48.9 48.26,48.9 48.26,35.56 0,35.56
N$1
  Bottom 0.406: U$3.20 55.88,15.67 D1.C 58.42,16 60.96,16 C20.1 C22.+
N$3
  Bottom 0.406: R1.2 95.25,51.96 OK1.8
N$5
  Bottom 0.6: B1.+ B1.-
N$6
  Bottom 0.406: R17.2 50.8,59.54 OK5.3
N$7
  Bottom 0.406: OK5.1 45.72,60.81 R18.2
N$10
  Bottom 0.6: B2.+ B2.-
N$11
  Bottom 0.406: R6.2 67.94,43.81 67.94,43.18 66.04,41.27 OK2.6
N$13
  Bottom 0.406: R2.2 90.17,42.44 OK1.6
N$14
  Bottom 0.406: R7.2 62.87,53.34 62.87,41.91 60.96,40.01 OK2.4
N$15
  Bottom 0.6: B3.+ B3.-
N$16
  Bottom 0.406: R3.2 83.19,53.98 83.19,42.55 85.09,40.64 OK1.4
N$17
  Bottom 0.406: R5.2 73.03,53.34 73.03,41.91 72.39,41.27 71.75,41.27 71.12,40.64 OK2.8
N$18
  Bottom 0.406: R4.2 80.01,42.44 OK1.2
N$19
  Bottom 0.6: B4.+ B4.-
N$20
  Bottom 0.406: R8.2 57.78,43.81 57.78,42.55 55.88,40.64 OK2.2
N$21
  Bottom 0.406: R9.2 44.98,40.64 46.35,40.64 46.99,40.01 OK3.8
N$22
  pour Bottom (isolate 0.4, rank 6): 0,36.2 99.69,36.2 99.69,80.01 0,80.01
N$23
  Bottom 0.406: R10.2 36.83,53.23 36.83,43.81 39.37,41.27 41.91,41.27 OK3.6
N$24
  Bottom 0.6: B5.+ B5.-
N$25
  Bottom 0.406: RESET.1 64.14,4.45 55.88,4.45 U$3.1
N$26
  Bottom 0.406: R11.2 31.11,44.45 33.02,42.55 34.18,41.27 36.83,41.27 OK3.4
N$27
  Bottom 0.6: B6.+ B6.-
N$29
  Bottom 0.406: R14.2 16.51,53.23 16.51,41.27 17.78,40.01 OK4.6
N$32
  Bottom 0.406: R12.2 26.67,53.23 26.67,43.81 31.75,38.73 OK3.2
N$35
  Bottom 0.6: B7.+ B7.-
N$36
  Bottom 0.406: R15.2 12.7,42.44 OK4.4
N$39
  Bottom 0.6: B8.+ B8.-
N$41
  Bottom 0.406: R13.2 22.86,42.44 OK4.8
N$42
  Bottom 0.406: R16.2 5.71,53.87 5.71,41.91 7.62,40.01 OK4.2
N$44
  Bottom 0.6: B9.+ B9.-
N$47
  Bottom 0.6: B10.+ B10.-
N$55
  Bottom 0.6: B11.+ B11.-
N$59
  Bottom 0.6: B12.+ B12.-
N$65
  Bottom 0.6: B13.+ B13.-
N$68
  Bottom 0.6: B14.+ B14.-
N$76
  Bottom 0.6: B15.+ B15.-
N$80
  Bottom 0.6: B16.+ B16.-
PS
  Bottom 0.254: 79.38,12.06 J2.6
  Bottom 0.406: 79.38,12.06 76.2,12.06 76.2,2.54 48.9,2.54 48.9,3.81 48.26,4.45 U$3.7 48.26,10.16 40.01,10.16 39.37,9.53 38.73,9.53 32.38,3.17 26.04,3.17 17.78,11.43 15.88,11.43 15.88,18.41 24.77,18.41 J1.6
RAILDATA  (via drill 0.5 pad 1.52)
  Top 0.406: v40.64,17.14 v65.41,17.14
  Bottom 0.406: J1.8 27.3,16.51 29.21,18.41 41.27,18.41 41.27,17.14 arc-90 v40.64,17.14 | v65.41,17.14 66.04,17.14 66.04,20.32 81.28,20.32 81.28,17.14 81.79,16.64 J2.8
RESET  (via drill 0.5 pad 1.52)
  Top 0.406: v40.64,13.34 v65.41,13.34
  Bottom 0.406: J1.7 26.04,13.97 26.67,13.34 v40.64,13.34 | v65.41,13.34 66.67,13.34 66.67,19.68 80.64,19.68 J2.7
VCC
  Bottom 0.406: SJ2.1 33.02,12.06 33.66,11.43 36.2,11.43 JP7.2 58.42,12.06 | J2.1 73.03,10.79 67.31,10.79 | 67.31,10.79 58.42,10.79 58.42,12.06 | 67.31,10.79 VCC.1 | 58.42,12.06 D1.A
VCC-S88
  Bottom 0.406: J1.1 18.54,13.97 19.05,13.97 21.59,11.43 30.48,11.43 30.99,11.94 SJ2.2

### Text on the board
Bottom: + | GBM16-SMD 16fach Gleisbesetztmeldung mit s88-N | Schaltung in Anlehnung an http://www.railway-lauf.de/ | Layout Rev/Bzr 4/21 - 01/2010 H.-P. Bock | MOSI | MISO | SCK | + | GND | + | VCC | RESET | + | +